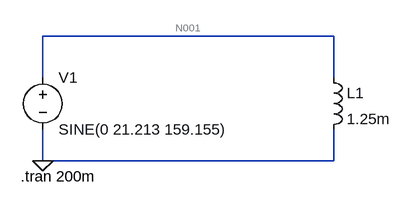
[diagram p0: schematic Draft1.asc]
Draft1.asc, the LTspice schematic file:
Version 4
SHEET 1 880 680
WIRE 528 -64 80 -64
WIRE 80 0 80 -64
WIRE 528 0 528 -64
WIRE 80 128 80 80
WIRE 528 128 528 80
WIRE 528 128 80 128
FLAG 80 128 0
SYMBOL voltage 80 -16 R0
WINDOW 123 0 0 Left 0
WINDOW 39 0 0 Left 0
SYMATTR InstName V1
SYMATTR Value SINE(0 21.213 159.155)
SYMBOL ind 512 -16 R0
SYMATTR InstName L1
SYMATTR Value 1.25m
SYMATTR SpiceLine Rser=5
TEXT 46 152 Left 2 !.tran 200m

The netlist it stands for:
* Draft1.asc
V1 N001 0 SINE(0 21.213 159.155)
L1 N001 0 1.25m Rser=5
.tran 200m
.backanno
.end

* Results of the author's LTspice run, read from the files saved beside the schematic
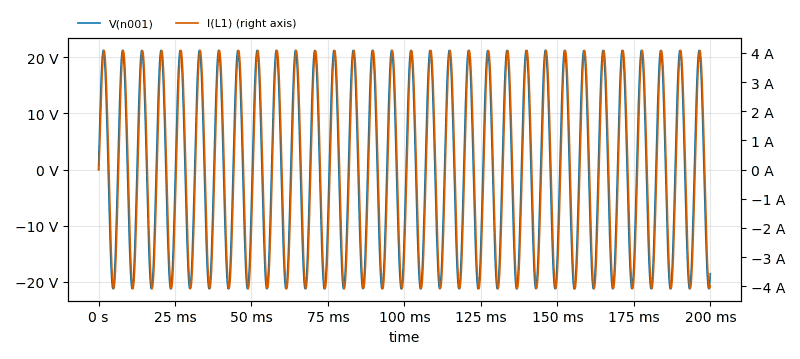
[diagram p1: Transient Analysis of Draft1.asc, plotted from the saved traces]
* Transient Analysis, 1 run:
*   V(n001): min -21.21 V, max 21.21 V, average 54.24 mV, rms 15.02 V, last -18.52 V
*   I(L1): min -4.086 A, max 4.086 A, average 15.7 mA, rms 2.888 A, last -3.973 A